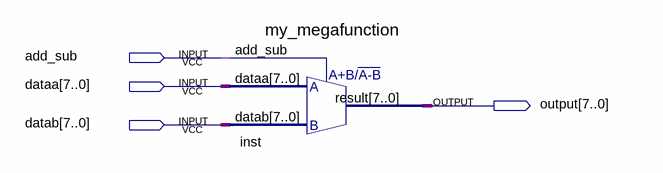
[diagram p0: schematic sheet]
// Quartus schematic Lab5.bdf as structural Verilog: 1 symbols, 4 pins
module Lab5 (
  input  add_sub,
  input  [7:0] dataa,
  input  [7:0] datab,
  output [7:0] \output 
);

  my_megafunction inst (.dataa(dataa), .datab(datab), .add_sub(add_sub), .result(\output ));
endmodule
